# Altium schematic sheet PART4_CMOS_Driver.SchDoc
size A4
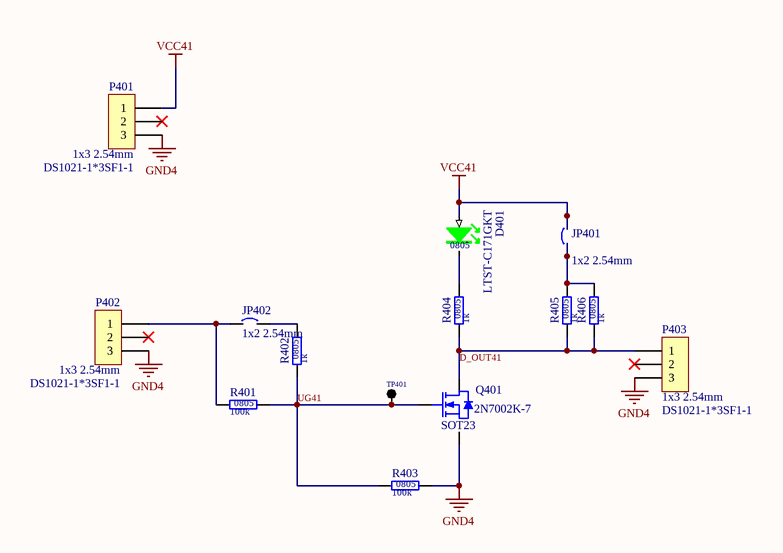
[diagram p0: PART4_CMOS_Driver.SchDoc]

## Parts
D401  value LTST-C171GKT  SCH_Footprint: 0805  [OL_0805_2012]  (hidden comment: Green led)
JP401  SCH_Footprint: 1x2 2.54mm  [P_HEADER_1x2_2.54]  (hidden comment: Goldpin)
JP402  SCH_Footprint: 1x2 2.54mm  [P_HEADER_1x2_2.54]  (hidden comment: Goldpin)
P401  value DS1021-1*3SF1-1  SCH_Footprint: 1x3 2.54mm  [P_HEADER_1x3_2.54]  (hidden comment: Goldpin)
P402  value DS1021-1*3SF1-1  SCH_Footprint: 1x3 2.54mm  [P_HEADER_1x3_2.54]  (hidden comment: Goldpin)
P403  value DS1021-1*3SF1-1  SCH_Footprint: 1x3 2.54mm  [P_HEADER_1x3_2.54]  (hidden comment: Goldpin)
Q401  SCH_Footprint: SOT23  [SOT23_TO236_SC59]  (hidden comment: 2N7002K-7)
R401  value 100k  SCH_Footprint: 0805  [R_0805_2012]  (hidden comment: Resistor)
R402  value 1k  SCH_Footprint: 0805  [R_0805_2012]  (hidden comment: Resistor)
R403  value 100k  SCH_Footprint: 0805  [R_0805_2012]  (hidden comment: Resistor)
R404  value 1k  SCH_Footprint: 0805  [R_0805_2012]  (hidden comment: Resistor)
R405  value 1k  SCH_Footprint: 0805  [R_0805_2012]  (hidden comment: Resistor)
R406  value 1k  SCH_Footprint: 0805  [R_0805_2012]  (hidden comment: Resistor)
TP401  Single pin  [TP_1PIN]  (value not drawn)

## Nets
GND4: P401.3 P402.3 P403.3 Q401.2(S) R403.2
VCC41: D401.2(A) JP401.2 P401.1
D_OUT41: P403.1 Q401.3(D) R404.1 R405.1 R406.1
UG41: Q401.1(G) R401.2 R402.1 R403.1 TP401.1(TP)
NetD401_1: D401.1(K) R404.2
NetJP401_1: JP401.1 R405.2 R406.2
NetJP402_1: JP402.1 P402.1 R401.1
NetJP402_2: JP402.2 R402.2

Not connected (* = marked no-connect by the designer): P401 2*; P402 2*; P403 2*

## Library data of the parts
D401 = OL_G_0805_0C006_LTST-C171GKT: LED GREEN; Manufacturer: Lite-On; Part Number: OL_G_0805_0C006_LTST-C171GKT; HelpURL: http://datasheet.octopart.com/LTST-C171GKT-Lite-On-datasheet-158474.pdf; Manufacturer Part Number: LTST-C171GKT; Supplier 1: TME; Supplier Part Number 1: LTST-C171GKT; Supplier 2: RS Components; Supplier Part Number 2: 6920935; Supplier 3: Farnell; Supplier 4: Mouser; Supplier Part Number 4: 859-LTST-C171GKT; Supplier 5: Digi-Key; Supplier Part Number 5: 160-1423-1-ND
JP401 JP402 = CB_GOLDPIN: Circuit Breaker; Part Number: CB_GOLDPIN; Component Type: Standard; Supplier 1: TME; Supplier 2: RS Components; Supplier 3: Farnell; Supplier 4: Mouser; Supplier 5: Digi-Key
P401-P403 = P_HEADER_1x3_2.54: Pin Header; Manufacturer: Connfly; Part Number: P_HEADER_1x3_2.54; Component Type: Standard; HelpURL: http://www.tme.eu/en/Document/cc301e58a5da78cb543a94b5a5b7f06a/DS1021.pdf; Manufacturer Part Number: DS1021-1*3SF1-1; Supplier 1: TME; Supplier Part Number 1: ZL201-03G; Supplier 2: RS Components; Supplier 3: Farnell; Supplier 4: Mouser; Supplier 5: Digi-Key
Q401 = QN_2N7002K-7_60V_350mA: Manufacturer: DIODES inc; Type: N-MOS; Voltage: 60V; Current: 0A8; Part Number: QN_2N7002K-7_60V_350mA; Value: 2N7002K-7; HelpURL: http://datasheet.octopart.com/2N7002K-7-Diodes-Inc.-datasheet-12515815.pdf; Manufacturer Part Number: 2N7002K-7; Supplier 1: TME; Supplier 2: RS Components; Supplier Part Number 2: 7703383; Supplier 3: Farnell; Supplier Part Number 3: 1713825; Supplier 4: Mouser; Supplier Part Number 4: 621-2N7002K-7; Supplier 5: Digi-Key; Supplier Part Number 5: 2N7002K-7DICT-ND
R401 R403 = R_100k_0805_1: Manufacturer: Yageo; Manufacturer Part Number: RC0805FR-07100KL; Voltage: 150V; Power: 125mW; Tolerance: 1%; Part Number: R_100k_0805_1; HelpURL: https://pl.mouser.com/datasheet/2/447/PYu-RC_Group_51_RoHS_L_9-1314892.pdf; Supplier 1: TME; Supplier Part Number 1: RC0805FR-07100K; Supplier 2: RS Components; Supplier 3: Farnell; Supplier Part Number 3: 9237879; Supplier 4: Mouser; Supplier Part Number 4: 603-RC0805FR-07100KL; Supplier 5: Digi-Key; Supplier Part Number 5: 311-100KCRCT-ND
R402 R404-R406 = R_1k_0805_1: Manufacturer: Royalohm; Manufacturer Part Number: HP05W3F1001T5E; Voltage: 150V; Power: 300mW; Tolerance: 1%; Part Number: R_1k_0805_1; HelpURL: https://www.tme.eu/pl/Document/63d5a2fbb689d2d511047d7cc8640cd8/chip_resistor_hp.pdf; Supplier 1: TME; Supplier Part Number 1: HP05-1K1%; Supplier 2: RS Components; Supplier 3: Farnell; Supplier 4: Mouser; Supplier 5: Digi-Key
TP401 = TP_1PIN: Testpoint; SCH_Footprint: Single; Part Number: TP_1PIN; Component Type: Standard; Supplier 1: TME; Supplier 2: RS Components; Supplier 3: Farnell; Supplier 4: Mouser; Supplier 5: Digi-Key